# Altium schematic sheet dep-switch-TPS22959DNYT.SchDoc
size A4
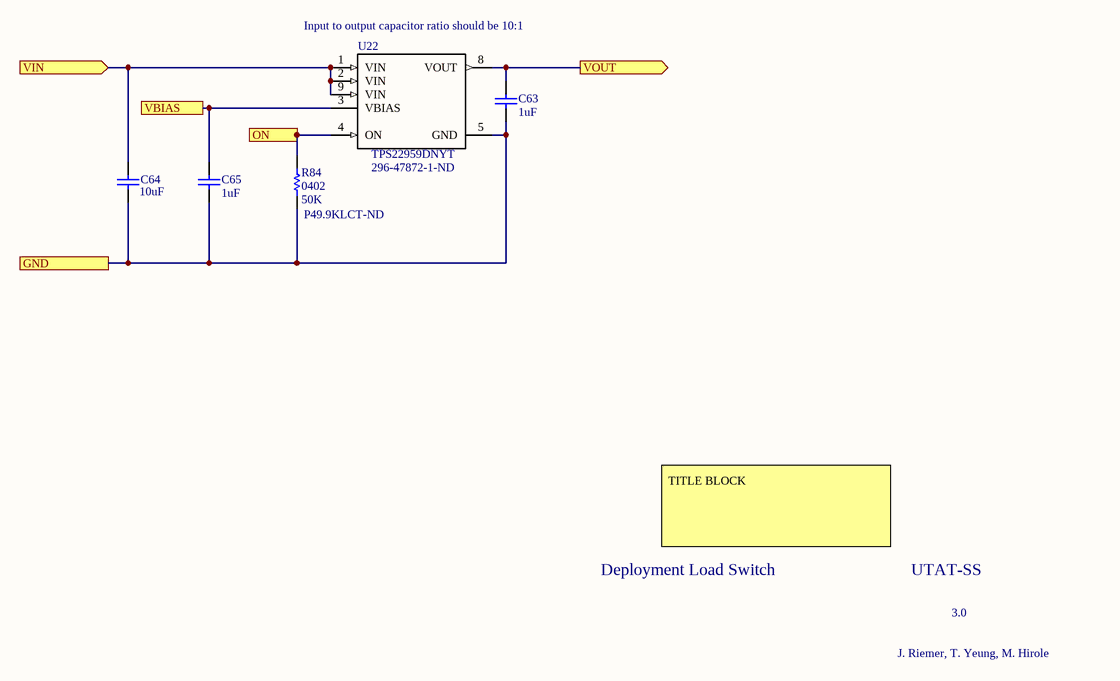
[diagram p0: dep-switch-TPS22959DNYT.SchDoc]

## Parts
C63  value 1uF  [CAP0603R]  (hidden comment: 0603)
C64  value 10uF  [CAP0805R]  (hidden comment: 0805)
C65  value 1uF  [CAP0603R]  (hidden comment: 0603)
R84  0402  value 50K  Supplier Part Number 1: P49.9KLCT-ND  [RES0402R]
U22  TPS22959DNYT  Supplier Part Number 1: 296-47872-1-ND  [TPS22959DNYT]

## Ports
GND, ON (in), VBIAS, VIN (in), VOUT (out)

## Nets
GND: C63.1 C64.1 C65.1 R84.1 U22.5(GND) ; port GND
ON: R84.2 U22.4(ON) ; port ON
VBIAS: C65.2 U22.3(VBIAS) ; port VBIAS
VIN: C64.2 U22.1(VIN) U22.2(VIN) U22.9(VIN) ; port VIN
VOUT: C63.2 U22.8(VOUT) ; port VOUT

## Notes on the sheet
- (near U22) Input to output capacitor ratio should be 10:1
- Deployment Load Switch
- TITLE BLOCK
- UTAT-SS
- 3.0
- J. Riemer, T. Yeung, M. Hirole

## Library data of the parts
C63 C65 = CAP0603: 0603 capacitor; Supplier 1: Digi-Key; Supplier Part Number 1: 1276-6524-6-ND; ComponentLink1Description: Datasheet; ComponentLink1URL: https://media.digikey.com/pdf/Data%20Sheets/Samsung%20PDFs/CL10B105MO8NNWC.pdf
C64 = CAP0805: 0805 capacitor; Supplier 1: Digi-Key; Supplier Part Number 1: 490-14381-6-ND; ComponentLink1Description: Datasheet; ComponentLink1URL: https://search.murata.co.jp/Ceramy/image/img/A01X/G101/ENG/GRM21BR71A106KA73-01.pdf
R84 = RES0402: 0402 resistor; Manufacturer: Panasonic; Manufacturer Part Number: ERJ-2RKF4992X; Description: PANASONIC ELECTRONIC COMPONENTS - ERJ-2RKF4992X. - Resistance:49.9kohm; Power Rating: 100mW; Resistance: 49.9kR; Tolerance: 1%; Voltage Rating: 50V; Temperature Coefficient: 100ppm/°C; Supplier 1: Digi-Key; Stock 1: 1480214; Pricing 1: 1=0.1, 10=0.045, 100=0.0183, 1000=0.00823, 2500=0.00715, 5000=0.0059 (USD); Mount: Surface Mount; Case/Package: 0402; Case Code (Metric): 1005; Case Code (Imperial): 0402; Contact Plating: Tin; Min Operating Temperature: -55°C; Max Operating Temperature: 155°C; Packaging: Tape and Reel; Package Quantity: 1; Composition: Thick Film; Number of Terminations: 2; Termination: SMD/SMT; Military Standard: Not; Max Power Dissipation: 100mW; Voltage Rating (DC): 50V; Features: Automotive AEC-Q200; Length: 1mm; Height: 0.35mm; Width: 0.02inch; Depth: 0.5mm; Radiation Hardening: No; REACH SVHC: No SVHC; Lead Free: Lead Free; ComponentLink1URL: http://www.jameco.com/Jameco/Products/ProdDS/1987353.pdf?src-supplier=Jameco; ComponentLink1Description: http://www.jameco.com/Jameco/Products/ProdDS/1987353.pdf?src-supplier=Jameco; ComponentLink2URL: http://industrial.panasonic.com/www-data/pdf/AOA0000/AOA0000CE2.pdf?src-supplier=Avnet; ComponentLink2Description: http://industrial.panasonic.com/www-data/pdf/AOA0000/AOA0000CE2.pdf?src-supplier=Avnet; ComponentLink3URL: http://industrial.panasonic.com/www-data/pdf/AOA0000/AOA0000CE2.pdf?src-supplier=Future+Electronics; ComponentLink3Description: http://industrial.panasonic.com/www-data/pdf/AOA0000/AOA0000CE2.pdf?src-supplier=Future+Electronics; ComponentLink4URL: http://industrial.panasonic.com/cdbs/www-data/pdf/RDA0000/AOA0000C304.pdf?src-supplier=Farnell; ComponentLink4Description: http://industrial.panasonic.com/cdbs/www-data/pdf/RDA0000/AOA0000C304.pdf?src-supplier=Farnell; ComponentLink5URL: http://www.farnell.com/datasheets/1678782.pdf?src-supplier=Element14; ComponentLink5Description: http://www.farnell.com/datasheets/1678782.pdf?src-supplier=Element14; ComponentLink6URL: https://www.alliedelec.com/m/d/623f45ff1957d936ff56d46fd1c28cac.pdf?src-supplier=Allied+Electronics; ComponentLink6Description: https://www.alliedelec.com/m/d/623f45ff1957d936ff56d46fd1c28cac.pdf?src-supplier=Allied+Electronics; ComponentLink7URL: http://www.farnell.com/datasheets/426256.pdf?src-supplier=Element14; ComponentLink7Description: http://www.farnell.com/datasheets/426256.pdf?src-supplier=Element14
U22 = TPS22959DNYT: 5.5V, 15A, 4.4mÎ© Load Switch with Quick Output Discharge 8-WSON -40 to 85; MF: Texas Instruments; Number of Outputs: 1; Quiescent Current: 20.4uA; Package: WSON-8 Texas Instruments; Digi-Key_Part_Number: 296-47872-1-ND; Digi-Key_Purchase_URL: https://www.digikey.ca/product-detail/en/texas-instruments/TPS22959DNYT/296-47872-1-ND/8133221?utm_source=snapeda&utm_medium=aggregator&utm_campaign=symbol; SnapEDA_Link: https://www.snapeda.com/parts/TPS22959DNYT/Texas%20Instruments/view-part/?ref=snap; MP: TPS22959DNYT; Value: *; Supplier 1: Digi-Key; Manufacturer: Texas Instruments; Manufacturer Part Number: TPS22959DNYT; Stock 1: 2432; Pricing 1: 1=1.91, 10=1.711, 100=1.3756 (USD); Mount: Surface Mount; Number of Pins: 8; Min Operating Temperature: -40°C; Max Operating Temperature: 85°C; Number of Channels: 1; Lead Free: Lead Free; ComponentLink1URL: http://www.ti.com/general/docs/lit/getliterature.tsp?genericPartNumber=TPS22959&&fileType=pdf&src-supplier=Avnet; ComponentLink1Description: http://www.ti.com/general/docs/lit/getliterature.tsp?genericPartNumber=TPS22959&&fileType=pdf&src-supplier=Avnet